# Altium schematic sheet Sensors.SchDoc: =Project Title
size A4; Author: Mohamat Eirban Ali; DocumentNumber: 5; Revision: 1; SheetNumber: 4; SheetTotal: 4
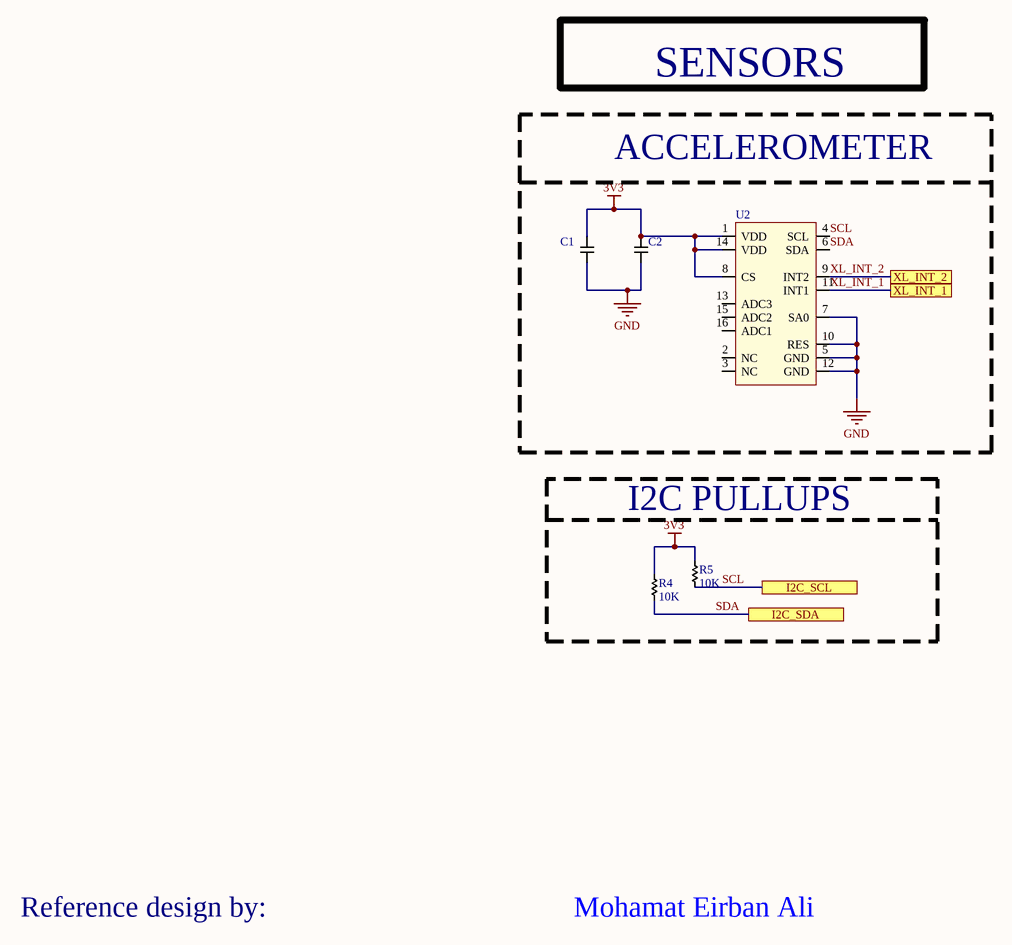
[diagram p0: Sensors.SchDoc]

## Parts
C1  (no value)  [CAP_0603_HIGH]
C2  (no value)  [CAP_0603_HIGH]
R4  10K  [RES_0603_HIGH]
R5  10K  [RES_0603_HIGH]
U2  (no value)  [LIS3DH]

## Blocks framed on the sheet
ACCELEROMETER: C1 C2 U2
I2C PULLUPS: R4 R5

## Ports
I2C_SCL, I2C_SDA, XL_INT_1, XL_INT_2

## Nets
3V3: C1.1 C2.1 R4.2 R5.2 U2.1(VDD) U2.8(CS) U2.14(VDD)
GND: C1.2 C2.2 U2.5(GND) U2.7(SA0) U2.10(RES) U2.12(GND)
SCL: R5.1 U2.4(SCL) ; port I2C_SCL
SDA: R4.1 U2.6(SDA) ; port I2C_SDA
XL_INT_1: U2.11(INT1) ; port XL_INT_1
XL_INT_2: U2.9(INT2) ; port XL_INT_2

Not connected (* = marked no-connect by the designer): U2 2(NC) 3(NC) 13(ADC3) 15(ADC2) 16(ADC1)

## Notes on the sheet
- SENSORS
- Reference design by:
- Mohamat Eirban Ali
- Title
- Size:
- Date:
- A4
- Number:
- Time:
- Revision:
- Sheet
- of
- File:

## Library data of the parts
C1 = Capacitor_0603: 0603 Capacitor; Manufacturer 1: Kyocera AVX; Manufacturer Part Number 1: F980J107MMAAXE; Capacitance: 100uF; Voltage Rating: 6.3V; ESR (Equivalent Series Resistance): 10R; Tolerance: 20%; Supplier 1: Digi-Key; Supplier Part Number 1: 478-9836-1-ND; Stock 1: 15476; Pricing 1: 1=0.67000, 10=0.49100, 100=0.33670, 500=0.26658, 1000=0.22448 (USD); RoHS: Yes; Mount: Surface Mount; Case/Package: 0603; Case Code (Metric): 1608; Case Code (Imperial): 0603; Min Operating Temperature: -55°C; Max Operating Temperature: 125°C; Packaging: Tape and Reel; Length: 0.063inch; Width: 0.033inch; Height - Seated (Max): 0.035inch; ComponentLink1URL: http://www.farnell.com/datasheets/2602422.pdf?src-supplier=Farnell; ComponentLink1Description: http://www.farnell.com/datasheets/2602422.pdf?src-supplier=Farnell; ComponentLink2URL: http://datasheets.avx.com/F98.pdf?src-supplier=Digi-Key; ComponentLink2Description: http://datasheets.avx.com/F98.pdf?src-supplier=Digi-Key
C2 = Capacitor_0603: 0603 Capacitor; Manufacturer 1: Murata; Manufacturer Part Number 1: GRM188R60J106ME47D; Material: Ceramic; Capacitance: 10uF; Tolerance: 20%; Voltage Rating: 6.3V; Dielectric: X5R; Supplier 1: Digi-Key; Supplier Part Number 1: 490-3896-1-ND; Stock 1: 20724673; Pricing 1: 1=0.37000, 10=0.25900, 100=0.15530, 500=0.11644, 1000=0.09833 (USD); RoHS: Yes; Mount: Surface Mount; Case/Package: 0603; Case Code (Metric): 1608; Case Code (Imperial): 0603; Min Operating Temperature: -55°C; Max Operating Temperature: 85°C; Packaging: Tape and Reel; Voltage Rating (DC): 6.3V; Package Quantity: 4000; Termination: SMD/SMT; Voltage: 6.3V; Length: 1.6mm; Height: 0.8mm; Width: 0.031inch; Depth: 0.8mm; Thickness: 0.035inch; Radiation Hardening: No; Lead Free: Lead Free; REACH SVHC: No SVHC; ComponentLink1URL: https://datasheet.ciiva.com/22776/1747457-22776418.pdf?src-supplier=Farnell; ComponentLink1Description: https://datasheet.ciiva.com/22776/1747457-22776418.pdf?src-supplier=Farnell; ComponentLink2URL: https://datasheet.ciiva.com/3777/10175grm188r60j106me4723-3777268.pdf?src-supplier=Arrow; ComponentLink2Description: https://datasheet.ciiva.com/3777/10175grm188r60j106me4723-3777268.pdf?src-supplier=Arrow; ComponentLink3URL: https://datasheet.ciiva.com/28584/415295-28584232.pdf?src-supplier=Element14; ComponentLink3Description: https://datasheet.ciiva.com/28584/415295-28584232.pdf?src-supplier=Element14; ComponentLink4URL: https://datasheet.ciiva.com/29202/450781-da-01-de-vs-chip-kond-0603-10-0-uf-20pr-6-3v-x5r-29202806.pdf?src-supplier=Conrad; ComponentLink4Description: https://datasheet.ciiva.com/29202/450781-da-01-de-vs-chip-kond-0603-10-0-uf-20pr-6-3v-x5r-29202806.pdf?src-supplier=Conrad; ComponentLink5URL: https://datasheet.ciiva.com/29199/454401-da-01-en-vs-kondensator-0603-29199677.pdf?src-supplier=Conrad; ComponentLink5Description: https://datasheet.ciiva.com/29199/454401-da-01-en-vs-kondensator-0603-29199677.pdf?src-supplier=Conrad; ComponentLink6URL: https://datasheet.ciiva.com/16373/l0005e-16373580.pdf?src-supplier=Future+Electronics; ComponentLink6Description: https://datasheet.ciiva.com/16373/l0005e-16373580.pdf?src-supplier=Future+Electronics; ComponentLink7URL: https://datasheet.ciiva.com/138/partnumbering-e-01-138658.pdf?src-supplier=Digi-Key; ComponentLink7Description: https://datasheet.ciiva.com/138/partnumbering-e-01-138658.pdf?src-supplier=Digi-Key; ComponentLink8URL: https://datasheet.ciiva.com/138/partnumbering-e-01-138659.pdf?src-supplier=Digi-Key; ComponentLink8Description: https://datasheet.ciiva.com/138/partnumbering-e-01-138659.pdf?src-supplier=Digi-Key; ComponentLink9URL: https://datasheet.ciiva.com/138/partnumbering-e-01-138660.pdf?src-supplier=Digi-Key; ComponentLink9Description: https://datasheet.ciiva.com/138/partnumbering-e-01-138660.pdf?src-supplier=Digi-Key; ComponentLink10URL: https://datasheet.ciiva.com/14116/grmseries-highdielectrictype-eng-14116428.pdf?src-supplier=Distrelec; ComponentLink10Description: https://datasheet.ciiva.com/14116/grmseries-highdielectrictype-eng-14116428.pdf?src-supplier=Distrelec
R4 R5 = Resistor_0603_3: 0603 Resistor
U2 = LIS3DH: LIS3DH ACCEL 2-16G I2C/SPI 16LGA